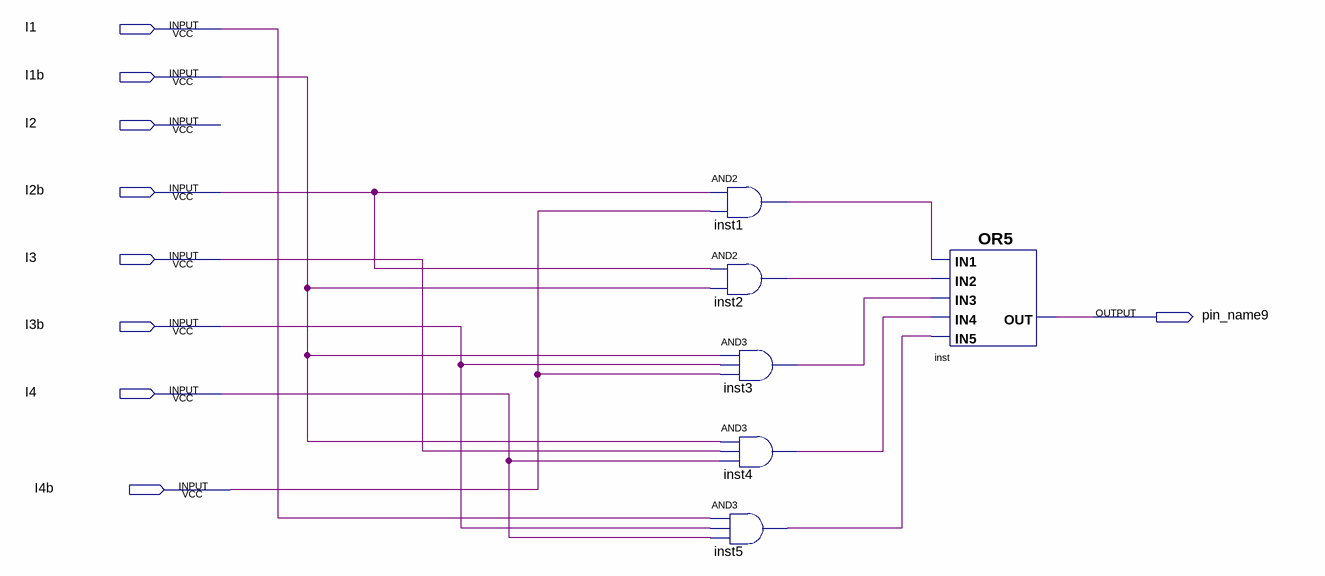
[diagram p0: schematic sheet]
// Quartus schematic funcb.bdf as structural Verilog: 6 symbols, 9 pins
module funcb (
  input  I1,
  input  I1b,
  input  I2,
  input  I2b,
  input  I3,
  input  I3b,
  input  I4,
  input  I4b,
  output pin_name9
);

  wire inst1_out, inst2_out, inst3_out, inst4_out, inst5_out;

  and inst1 (inst1_out, I2b, I4b);
  and inst2 (inst2_out, I2b, I1b);
  and inst3 (inst3_out, I1b, I3b, I4b);
  and inst4 (inst4_out, I1b, I3, I4);
  and inst5 (inst5_out, I1, I3b, I4);
  or inst (pin_name9, inst1_out, inst2_out, inst3_out, inst4_out, inst5_out);
endmodule
